# Altium schematic sheet Motor2.SchDoc
size A4
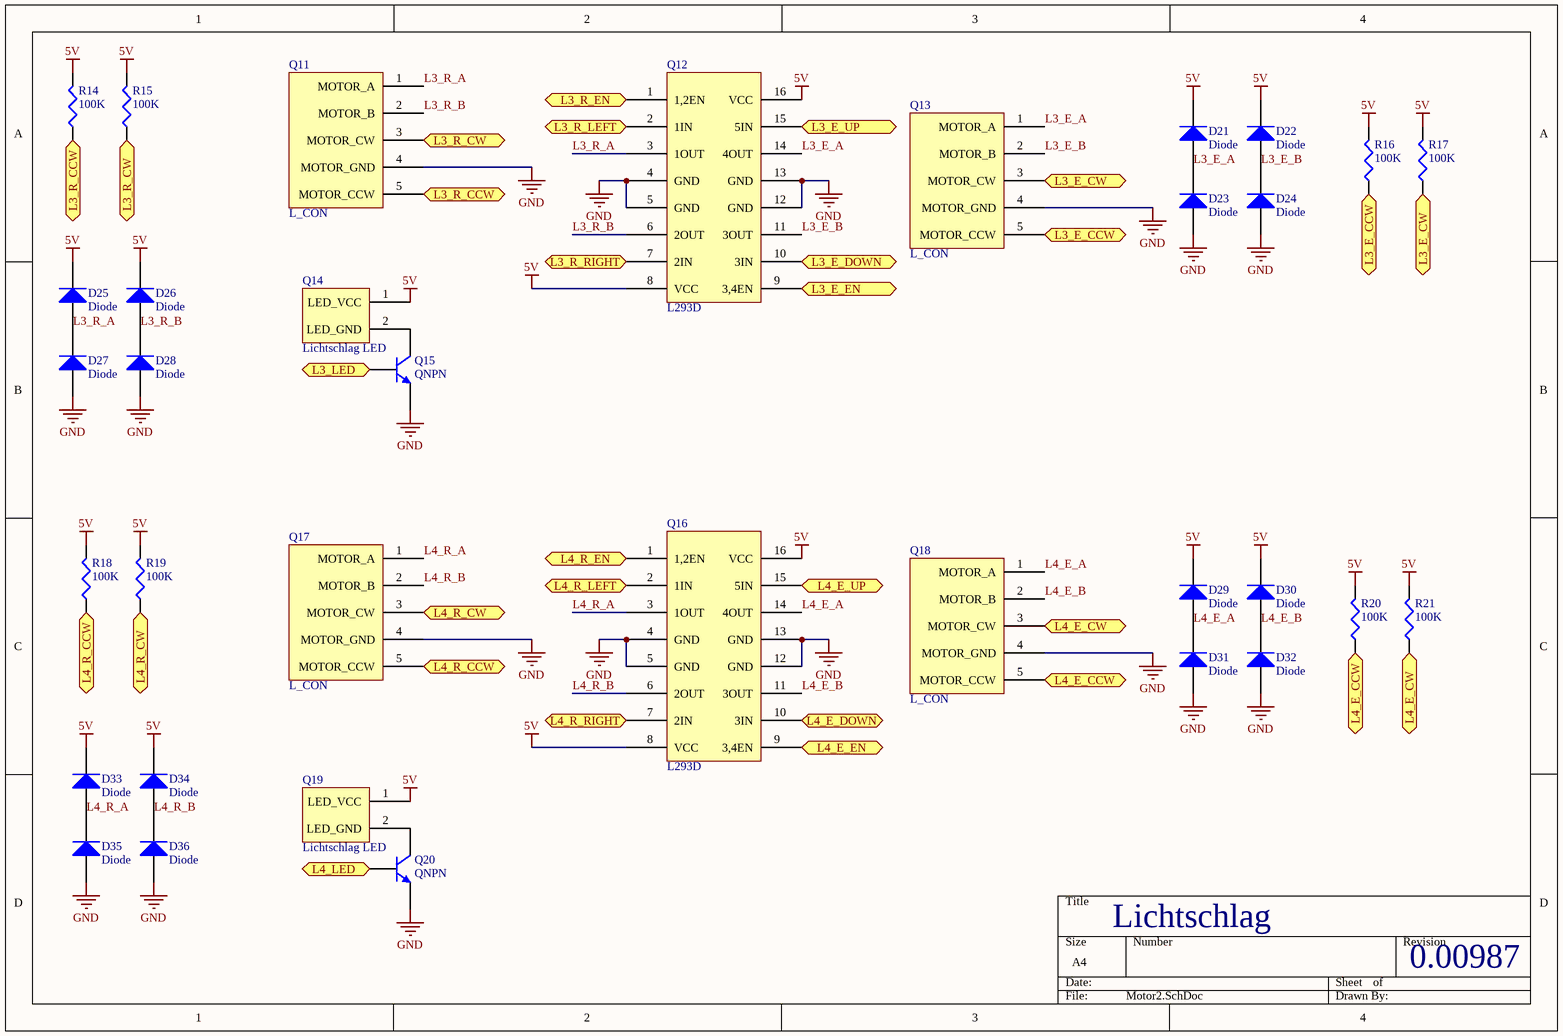
[diagram p0: Motor2.SchDoc]

## Parts
D21  Diode  [3.5X2.8X1.9]
D22  Diode  [3.5X2.8X1.9]
D23  Diode  [3.5X2.8X1.9]
D24  Diode  [3.5X2.8X1.9]
D25  Diode  [3.5X2.8X1.9]
D26  Diode  [3.5X2.8X1.9]
D27  Diode  [3.5X2.8X1.9]
D28  Diode  [3.5X2.8X1.9]
D29  Diode  [3.5X2.8X1.9]
D30  Diode  [3.5X2.8X1.9]
D31  Diode  [3.5X2.8X1.9]
D32  Diode  [3.5X2.8X1.9]
D33  Diode  [3.5X2.8X1.9]
D34  Diode  [3.5X2.8X1.9]
D35  Diode  [3.5X2.8X1.9]
D36  Diode  [3.5X2.8X1.9]
Q11  L_CON  [Lichschlag Connector]
Q12  L293D  [L293D]
Q13  L_CON  [Lichschlag Connector]
Q14  Lichtschlag LED  [Lichtschlag LED]
Q15  QNPN  [SOT-23B_L]
Q16  L293D  [L293D]
Q17  L_CON  [Lichschlag Connector]
Q18  L_CON  [Lichschlag Connector]
Q19  Lichtschlag LED  [Lichtschlag LED]
Q20  QNPN  [SOT-23B_L]
R14  100K  [6-0805_N]
R15  100K  [6-0805_N]
R16  100K  [6-0805_N]
R17  100K  [6-0805_N]
R18  100K  [6-0805_N]
R19  100K  [6-0805_N]
R20  100K  [6-0805_N]
R21  100K  [6-0805_N]

## Ports
L3_E_CCW (out), L3_E_CW (out), L3_E_DOWN (in), L3_E_EN (in), L3_E_UP (in), L3_LED (in), L3_R_CCW (out), L3_R_CW (out), L3_R_EN (in), L3_R_LEFT (in), L3_R_RIGHT (in), L4_E_CCW (out), L4_E_CW (out), L4_E_DOWN (in), L4_E_EN (in), L4_E_UP (in), L4_LED (in), L4_R_CCW (out), L4_R_CW (out), L4_R_EN (in), L4_R_LEFT (in), L4_R_RIGHT (in)

## Nets
5V: D21.2(K) D22.2(K) D25.2(K) D26.2(K) D29.2(K) D30.2(K) D33.2(K) D34.2(K) Q12.8(VCC) Q12.16(VCC) Q14.1(LED_VCC) Q16.8(VCC) Q16.16(VCC) Q19.1(LED_VCC) R14.2 R15.2 R16.2 R17.2 R18.2 R19.2 R20.2 R21.2
GND: D23.1(A) D24.1(A) D27.1(A) D28.1(A) D31.1(A) D32.1(A) D35.1(A) D36.1(A) Q11.4(MOTOR_GND) Q12.4(GND) Q12.5(GND) Q12.12(GND) Q12.13(GND) Q13.4(MOTOR_GND) Q15.3(E) Q16.4(GND) Q16.5(GND) Q16.12(GND) Q16.13(GND) Q17.4(MOTOR_GND) Q18.4(MOTOR_GND) Q20.3(E)
L3_E_A: D21.1(A) D23.2(K) Q12.14(4OUT) Q13.1(MOTOR_A)
L3_E_B: D22.1(A) D24.2(K) Q12.11(3OUT) Q13.2(MOTOR_B)
L3_E_CCW: Q13.5(MOTOR_CCW) R16.1 ; port L3_E_CCW
L3_E_CW: Q13.3(MOTOR_CW) R17.1 ; port L3_E_CW
L3_E_DOWN: Q12.10(3IN) ; port L3_E_DOWN
L3_E_EN: Q12.9(3,4EN) ; port L3_E_EN
L3_E_UP: Q12.15(5IN) ; port L3_E_UP
L3_LED: Q15.2(B) ; port L3_LED
L3_R_A: D25.1(A) D27.2(K) Q11.1(MOTOR_A) Q12.3(1OUT)
L3_R_B: D26.1(A) D28.2(K) Q11.2(MOTOR_B) Q12.6(2OUT)
L3_R_CCW: Q11.5(MOTOR_CCW) R14.1 ; port L3_R_CCW
L3_R_CW: Q11.3(MOTOR_CW) R15.1 ; port L3_R_CW
L3_R_EN: Q12.1(1,2EN) ; port L3_R_EN
L3_R_LEFT: Q12.2(1IN) ; port L3_R_LEFT
L3_R_RIGHT: Q12.7(2IN) ; port L3_R_RIGHT
L4_E_A: D29.1(A) D31.2(K) Q16.14(4OUT) Q18.1(MOTOR_A)
L4_E_B: D30.1(A) D32.2(K) Q16.11(3OUT) Q18.2(MOTOR_B)
L4_E_CCW: Q18.5(MOTOR_CCW) R20.1 ; port L4_E_CCW
L4_E_CW: Q18.3(MOTOR_CW) R21.1 ; port L4_E_CW
L4_E_DOWN: Q16.10(3IN) ; port L4_E_DOWN
L4_E_EN: Q16.9(3,4EN) ; port L4_E_EN
L4_E_UP: Q16.15(5IN) ; port L4_E_UP
L4_LED: Q20.2(B) ; port L4_LED
L4_R_A: D33.1(A) D35.2(K) Q16.3(1OUT) Q17.1(MOTOR_A)
L4_R_B: D34.1(A) D36.2(K) Q16.6(2OUT) Q17.2(MOTOR_B)
L4_R_CCW: Q17.5(MOTOR_CCW) R18.1 ; port L4_R_CCW
L4_R_CW: Q17.3(MOTOR_CW) R19.1 ; port L4_R_CW
L4_R_EN: Q16.1(1,2EN) ; port L4_R_EN
L4_R_LEFT: Q16.2(1IN) ; port L4_R_LEFT
L4_R_RIGHT: Q16.7(2IN) ; port L4_R_RIGHT
NetQ14_2: Q14.2(LED_GND) Q15.1(C)
NetQ19_2: Q19.2(LED_GND) Q20.1(C)

## Notes on the sheet
- Lichtschlag
- 0.00987

## Library data of the parts
D21-D36 = Diode: Default Diode; Published: 8-Jun-2000; LatestRevisionDate: 17-Jul-2002; LatestRevisionNote: Re-released for DXP Platform.; PackageVersion: Sep-1996; PackageReference: SMC; Publisher: Altium Limited; PackageDescription: DO-214-AB/SMC; 2 C-Bend Leads; Body 7.9 x 5.9 mm, inc. leads (LxW); Code_JEDEC: DO-214-AB; Reichelt: https://secure.reichelt.de/1N-UF-AA-Dioden/1N-4148-SMD/3//index.html?ACTION=3&GROUPID=2987&ARTICLE=18403&SEARCH=diode%20SMD&OFFSET=16&WKID=0&
Q11 Q13 Q17 Q18 = Lichtschlag Connector
Q12 Q16 = L293D: H-Bridge
Q14 Q19 = Lichtschlag LED: NPN General Purpose Amplifier
Q15 Q20 = QNPN: NPN Bipolar Transistor; Published: 8-Jun-2000; LatestRevisionDate: 29-May-2009; LatestRevisionNote: IPC-7351 Footprint Added.; PackageVersion: Aug-1999; PackageReference: SOT-23B; Publisher: Altium Limited; PackageDescription: 3-Pin SOT-23 Package 0.95 mm Pitch, 2.4 mm Lead Span; Reichelt: https://secure.reichelt.de/BC-Transistoren/BC-848A-SMD/3//index.html?ACTION=3&GROUPID=2881&ARTICLE=18564&SEARCH=NPN%20SMD&OFFSET=16&WKID=0&
R14-R21 = Res3: Resistor; Published: 8-Jun-2000; LatestRevisionDate: 29-May-2009; LatestRevisionNote: IPC-7351 Footprint Added.; PackageReference: J1-0603; Publisher: Altium Limited; PackageDescription: Chip Resistor; Value: 100K; Reichelt: https://secure.reichelt.de/SMD-0805-100-k-Ohm-820-k-Ohm/SMD-0805-100K/3//index.html?ACTION=3&GROUPID=3099&ARTICLE=32910&SEARCH=100k%20SMD%200805&OFFSET=16&WKID=0&